# Altium schematic sheet PowerManager.SchDoc
size A4
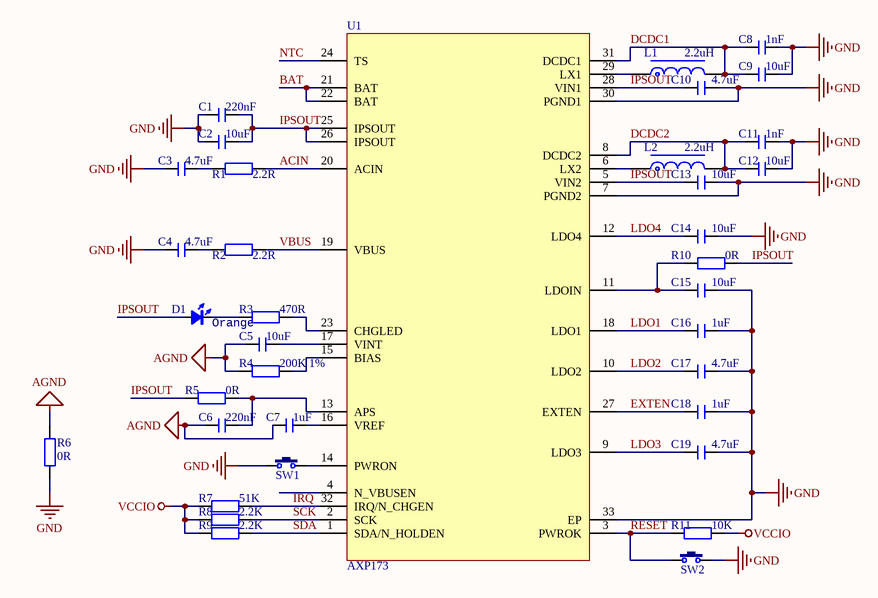
[diagram p0: PowerManager.SchDoc]

## Parts
C1  220nF  [C 0603_L]
C2  10uF  [C 0603_L]
C3  4.7uF  [C 0603_L]
C4  4.7uF  [C 0603_L]
C5  10uF  [C 0603_L]
C6  220nF  [C 0603_L]
C7  1uF  [C 0603_L]
C8  1nF  [C 0603_L]
C9  10uF  [C 0805_L]
C10  4.7uF  [C 0603_L]
C11  1nF  [C 0603_L]
C12  10uF  [C 0805_L]
C13  10uF  [C 0603_L]
C14  10uF  [C 0603_L]
C15  10uF  [C 0603_L]
C16  1uF  [C 0603_L]
C17  4.7uF  [C 0603_L]
C18  1uF  [C 0603_L]
C19  4.7uF  [C 0603_L]
D1  Orange  [LED_0603_ORANGE]
L1  2.2uH  [NR3015]
L2  2.2uH  [NR3015]
R1  2.2R  [R 0603_L]
R2  2.2R  [R 0603_L]
R3  470R  [R 0603_L]
R4  200K 1%  [R 0603_L]
R5  0R  [R 0603_L]
R6  0R  [R 0603_L]
R7  51K  [R 0603_L]
R8  2.2K  [R 0603_L]
R9  2.2K  [R 0603_L]
R10  0R  [R 0603_L]
R11  10K  [R 0603_L]
SW1  3x6x5  [TSW 3*6*4.3-S-W]  (value not drawn)
SW2  3x6x5  [TSW 3*6*4.3-S-W]  (value not drawn)
U1  AXP173  [QFN32 5x5_L]

## Nets
AGND: C5.2 C6.2 C7.2 R4.2 R6.2
GND: C1.1 C2.1 C3.1 C4.1 C8.1 C9.2 C10.2 C11.1 C12.2 C13.2 C14.2 C15.2 C16.2 C17.2 C18.2 C19.2 R6.1 SW1.1 SW2.2 U1.7(PGND2) U1.30(PGND1) U1.33(EP)
VCCIO: R7.2 R8.2 R9.2 R11.1
ACIN: R1.2 U1.20(ACIN)
BAT: U1.21(BAT) U1.22(BAT)
DCDC1: C8.2 C9.1 L1.2 U1.31(DCDC1)
DCDC2: C11.2 C12.1 L2.2 U1.8(DCDC2)
EXTEN: C18.1 U1.27(EXTEN)
IPSOUT: C1.2 C2.2 C10.1 C13.1 D1.1(A) R5.2 R10.1 U1.5(VIN2) U1.25(IPSOUT) U1.26(IPSOUT) U1.28(VIN1)
IRQ: R7.1 U1.32(IRQ/N_CHGEN)
LDO1: C16.1 U1.18(LDO1)
LDO2: C17.1 U1.10(LDO2)
LDO3: C19.1 U1.9(LDO3)
LDO4: C14.1 U1.12(LDO4)
NTC: U1.24(TS)
RESET: R11.2 SW2.1 U1.3(PWROK)
SCK: R8.1 U1.2(SCK)
SDA: R9.1 U1.1(SDA/N_HOLDEN)
VBUS: R2.2 U1.19(VBUS)
NetC3_2: C3.2 R1.1
NetC4_2: C4.2 R2.1
NetC5_1: C5.1 U1.17(VINT)
NetC6_1: C6.1 R5.1 U1.13(APS)
NetC7_1: C7.1 U1.16(VREF)
NetC15_1: C15.1 R10.2 U1.11(LDOIN)
NetD1_2: D1.2(K) R3.1
NetL1_1: L1.1 U1.29(LX1)
NetL2_1: L2.1 U1.6(LX2)
NetR3_2: R3.2 U1.23(CHGLED)
NetR4_1: R4.1 U1.15(BIAS)
NetSW1_2: SW1.2 U1.14(PWRON)

Not connected (* = marked no-connect by the designer): U1 4(N_VBUSEN)

## Library data of the parts
C1-C19 = C: 无极性贴片电容; 版权归属: 源创客; BOM名称: 无极性贴片电容; 学习资源: www.ooocke.com
D1 = LED_0603: LED; Type: 0603; Value: Orange
L1 L2 = L-NR: NR磁胶电感; 版权归属: 源创客; BOM名称: NR磁胶电感; 学习资源: www.ooocke.com
R1-R11 = R: 贴片电阻; 版权归属: 源创客; BOM名称: 贴片电阻; 学习资源: www.ooocke.com
SW1 SW2 = TSW 3x6: 3x6轻触开关; 版权归属: 源创客; BOM名称: 3x6轻触开关; 学习资源: www.ooocke.com